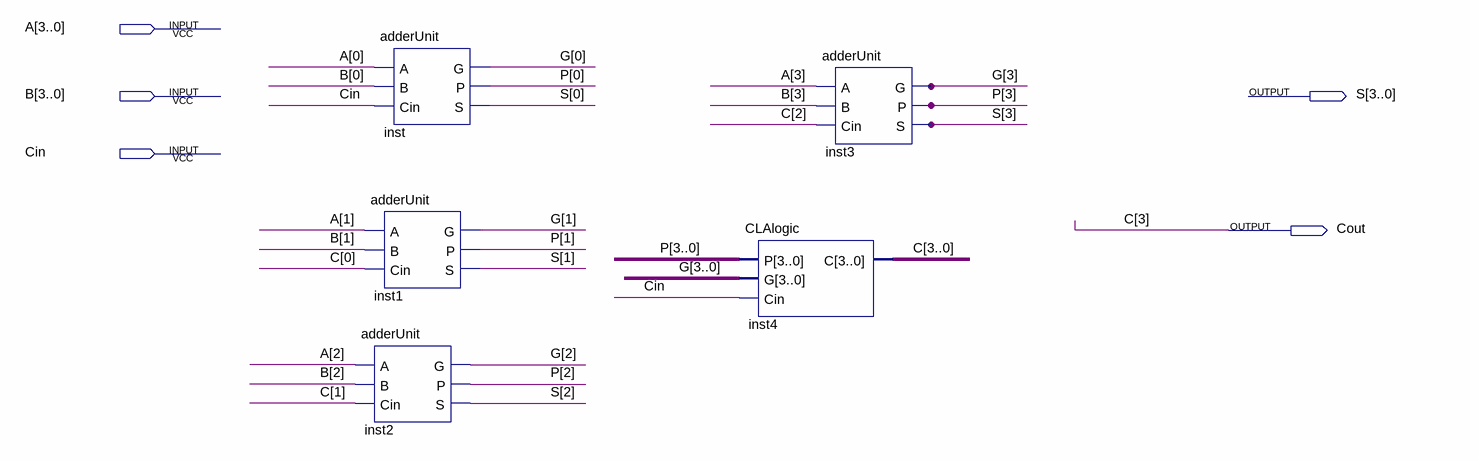
[diagram p0: schematic sheet]
// Quartus schematic sumCLA.bdf as structural Verilog: 5 symbols, 5 pins
module sumCLA (
  input  [3:0] A,
  input  [3:0] B,
  input  Cin,
  output [3:0] S,
  output Cout
);

  wire [2:0] C;
  wire [3:0] G, P;

  adderUnit inst1 (.A(A[1]), .B(B[1]), .Cin(C[0]), .G(G[1]), .P(P[1]), .S(S[1]));
  adderUnit inst2 (.A(A[2]), .B(B[2]), .Cin(C[1]), .G(G[2]), .P(P[2]), .S(S[2]));
  adderUnit inst (.A(A[0]), .B(B[0]), .Cin(Cin), .G(G[0]), .P(P[0]), .S(S[0]));
  CLAlogic inst4 (.P(P), .G(G), .Cin(Cin), .C({Cout, C}));
  adderUnit inst3 (.A(A[3]), .B(B[3]), .Cin(C[2]), .G(G[3]), .P(P[3]), .S(S[3]));

  // Other names for the same wires on the sheet: C[3] = Cout
endmodule
